# Altium project BatteryMonitor.PrjPcb
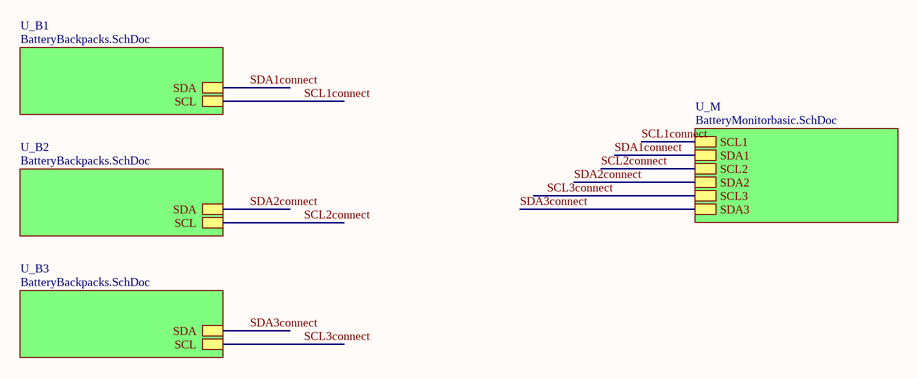
[diagram p0: BatteryMonitor.SchDoc]
3 sheets, 196 parts. Net scope: hierarchical (ports join the sheet entries above them; power ports are global).
Board files: BatteryMonitor1try.PcbDoc, BatteryMonitor.PcbDoc
Sheets:
  BatteryMonitor.SchDoc
    U_B1 = BatteryBackpacks.SchDoc
    U_M = BatteryMonitorbasic.SchDoc
    U_B2 = BatteryBackpacks.SchDoc
    U_B3 = BatteryBackpacks.SchDoc

## Sheet BatteryMonitor.SchDoc
size A

### Sub-sheets
U_B1 = BatteryBackpacks.SchDoc: SCL, SDA
U_B2 = BatteryBackpacks.SchDoc: SCL, SDA
U_B3 = BatteryBackpacks.SchDoc: SCL, SDA
U_M = BatteryMonitorbasic.SchDoc: SCL1, SDA1, SCL2, SDA2, SCL3, SDA3

### Nets
SCL1connect: sheet U_B1/SCL, sheet U_M/SCL1  [project net SCL to I2C isolator 1]
SCL2connect: sheet U_M/SCL2, sheet U_B2/SCL  [project net SCL to I2C isolator 2]
SCL3connect: sheet U_M/SCL3, sheet U_B3/SCL  [project net SCL to I2C isolator 3]
SDA1connect: sheet U_B1/SDA, sheet U_M/SDA1  [project net SDA to I2C isolator 1]
SDA2connect: sheet U_M/SDA2, sheet U_B2/SDA  [project net SDA to I2C isolator 2]
SDA3connect: sheet U_M/SDA3, sheet U_B3/SDA  [project net SDA to I2C isolator 3]

## Sheet BatteryBackpacks.SchDoc
size A
Used 3 times, as channels U_B1, U_B2, U_B3. Parts and nets are listed once, with the designators drawn on the sheet.
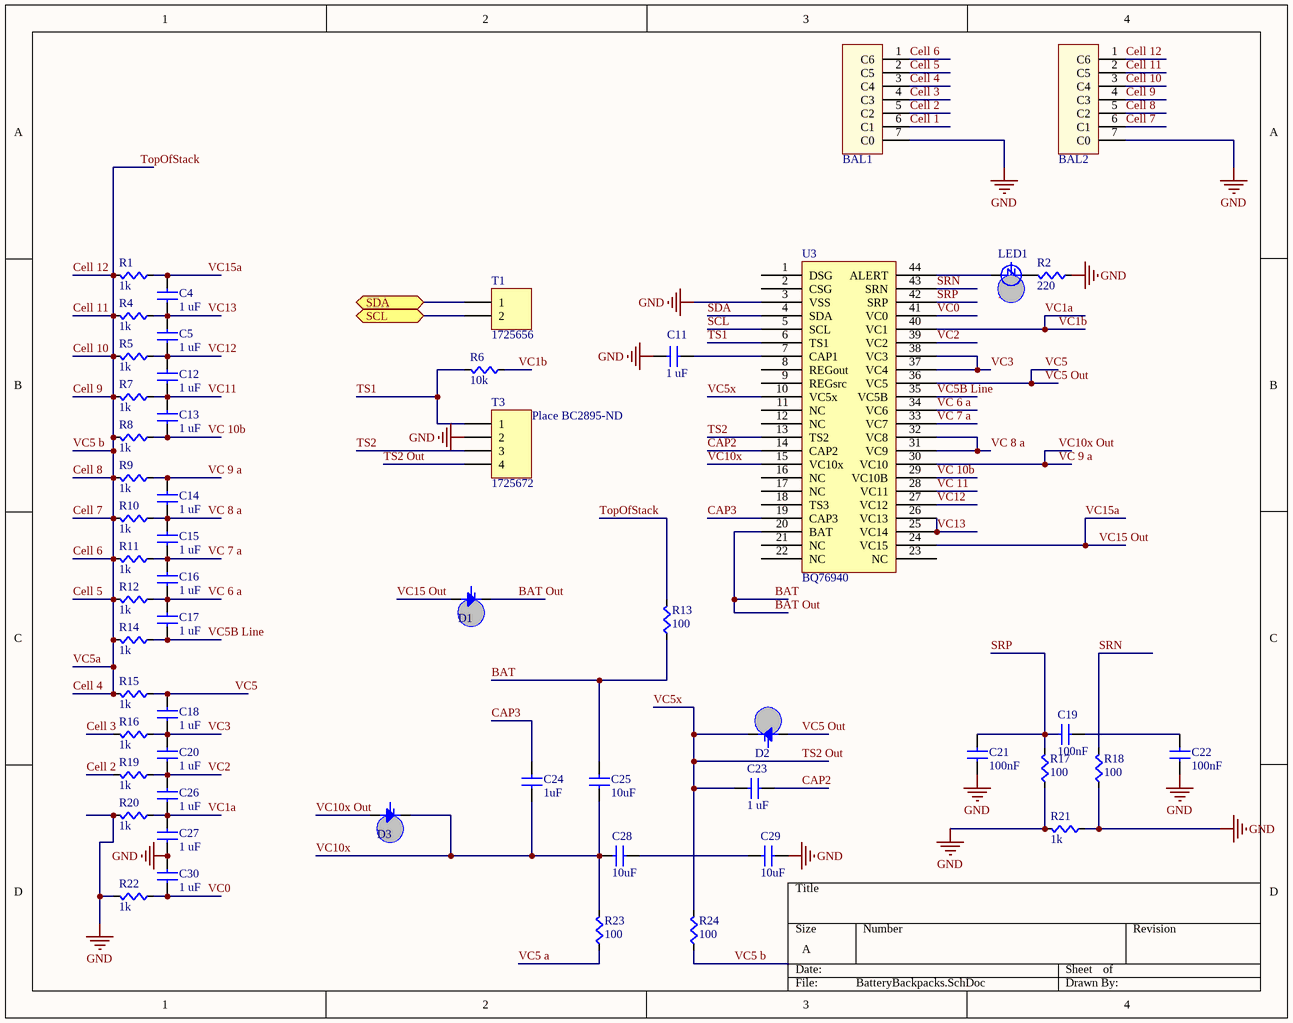
[diagram p1: BatteryBackpacks.SchDoc]

### Parts
BAL1  JST1x7  [JST1x7]  (value not drawn)
BAL2  JST1x7  [JST1x7]  (value not drawn)
C4  value 1 uF  [CAPC0603]  (hidden comment: Cap)
C5  value 1 uF  [CAPC0603]  (hidden comment: Cap)
C11  value 1 uF  [CAPC0603]  (hidden comment: Cap)
C12  value 1 uF  [CAPC0603]  (hidden comment: Cap)
C13  value 1 uF  [CAPC0603]  (hidden comment: Cap)
C14  value 1 uF  [CAPC0603]  (hidden comment: Cap)
C15  value 1 uF  [CAPC0603]  (hidden comment: Cap)
C16  value 1 uF  [CAPC0603]  (hidden comment: Cap)
C17  value 1 uF  [CAPC0603]  (hidden comment: Cap)
C18  value 1 uF  [CAPC0603]  (hidden comment: Cap)
C19  value 100nF  [CAPC0603]  (hidden comment: Cap)
C20  value 1 uF  [CAPC0603]  (hidden comment: Cap)
C21  value 100nF  [CAPC0603]  (hidden comment: Cap)
C22  value 100nF  [CAPC0603]  (hidden comment: Cap)
C23  value 1 uF  [CAPC0603]  (hidden comment: Cap)
C24  value 1uF  [CAPC0603]  (hidden comment: Cap)
C25  value 10uF  [CAPC0603]  (hidden comment: Cap)
C26  value 1 uF  [CAPC0603]  (hidden comment: Cap)
C27  value 1 uF  [CAPC0603]  (hidden comment: Cap)
C28  value 10uF  [CAPC0603]  (hidden comment: Cap)
C29  value 10uF  [CAPC0603]  (hidden comment: Cap)
C30  value 1 uF  [CAPC0603]  (hidden comment: Cap)
D1  Diode  [TEMD5510FX01]  (value not drawn)
D2  Diode  [TEMD5510FX01]  (value not drawn)
D3  Diode  [TEMD5510FX01]  (value not drawn)
LED1  Color: Red  [LED0603]  (hidden comment: LED)
R1  value 1k  [RES0603]  (hidden comment: Res)
R2  value 220  [RES0603]  (hidden comment: Res)
R4  value 1k  [RES0603]  (hidden comment: Res)
R5  value 1k  [RES0603]  (hidden comment: Res)
R6  value 10k  [RES0603]  (hidden comment: Res)
R7  value 1k  [RES0603]  (hidden comment: Res)
R8  value 1k  [RES0603]  (hidden comment: Res)
R9  value 1k  [RES0603]  (hidden comment: Res)
R10  value 1k  [RES0603]  (hidden comment: Res)
R11  value 1k  [RES0603]  (hidden comment: Res)
R12  value 1k  [RES0603]  (hidden comment: Res)
R13  value 100  [RES0603]  (hidden comment: Res)
R14  value 1k  [RES0603]  (hidden comment: Res)
R15  value 1k  [RES0603]  (hidden comment: Res)
R16  value 1k  [RES0603]  (hidden comment: Res)
R17  value 100  [RES0603]  (hidden comment: Res)
R18  value 100  [RES0603]  (hidden comment: Res)
R19  value 1k  [RES0603]  (hidden comment: Res)
R20  value 1k  [RES0603]  (hidden comment: Res)
R21  value 1k  [RES0603]  (hidden comment: Res)
R22  value 1k  [RES0603]  (hidden comment: Res)
R23  value 100  [RES0603]  (hidden comment: Res)
R24  value 100  [RES0603]  (hidden comment: Res)
T1  1725656  [1725656]
T3  1725672  [1725672]
U3  BQ76940  [BQ7694003DBT]

### Ports
SCL, SDA

### Nets
GND: BAL1.7(C0) BAL2.7(C0) C11.1(A) C21.2(B) C22.2(B) C27.1(A) C29.2(B) C30.2(B) R2.2(B) R17.2(B) R18.2(B) R20.1(A) R21.1(A) R21.2(B) R22.1(A) T3.2 U3.3(VSS)
BAT: C25.1(A) D1.C R13.2(B) U3.20(BAT)  [also labelled BAT Out]
CAP2: C23.2(B) U3.14(CAP2)
CAP3: C24.1(A) U3.19(CAP3)
Cell 1: BAL1.6(C1)
Cell 2: BAL1.5(C2) R19.1(A)
Cell 3: BAL1.4(C3) R16.1(A)
Cell 10: BAL1.1(C6) BAL1.2(C5) BAL1.3(C4) BAL2.1(C6) BAL2.2(C5) BAL2.3(C4) BAL2.4(C3) BAL2.5(C2) BAL2.6(C1) R1.1(A) R4.1(A) R5.1(A) R7.1(A) R8.1(A) R9.1(A) R10.1(A) R11.1(A) R12.1(A) R13.1(A) R14.1(A) R15.1(A) R24.2(B)  [also labelled Cell 11, Cell 12, Cell 4, Cell 5, Cell 6, Cell 7, Cell 8, Cell 9, TopOfStack, VC5 b, VC5a]
SCL: U3.5(SCL)
SCL: T1.2 ; port SCL  [a separate net that carries the same name]
SDA: U3.4(SDA)
SDA: T1.1 ; port SDA  [a separate net that carries the same name]
SRN: R18.1(A) U3.43(SRN)
SRP: C19.1(A) C21.1(A) R17.1(A) U3.42(SRP)
TS1: R6.1(A) T3.1 U3.6(TS1)
TS2: T3.3 U3.13(TS2)
TS2 Out: C23.1(A) D2.C R24.1(A) T3.4 U3.10(VC5x)  [also labelled VC5x]
VC0: C30.1(A) R22.2(B) U3.41(VC0)
VC1a: C26.1(A) C27.2(B) R6.2(B) R20.2(B) U3.40(VC1)  [also labelled VC1b]
VC2: C20.1(A) C26.2(B) R19.2(B) U3.39(VC2)
VC3: C18.1(A) C20.2(B) R16.2(B) U3.37(VC4) U3.38(VC3)
VC5: C18.2(B) D2.A R15.2(B) U3.36(VC5)  [also labelled VC5 Out]
VC5 a: R23.2(B)
VC5B Line: C17.1(A) R14.2(B) U3.35(VC5B)
VC10x: C24.2(B) C25.2(B) C28.1(A) D3.C R23.1(A) U3.15(VC10x)
VC11: C12.1(A) C13.2(B) R7.2(B)
VC12: C5.1(A) C12.2(B) R5.2(B) U3.27(VC12)
VC13: C4.1(A) C5.2(B) R4.2(B) U3.25(VC14) U3.26(VC13)
VC15 Out: C4.2(B) D1.A R1.2(B) U3.24(VC15)  [also labelled VC15a]
VC 6 a: C16.1(A) C17.2(B) R12.2(B) U3.34(VC6)
VC 7 a: C15.1(A) C16.2(B) R11.2(B) U3.33(VC7)
VC 8 a: C14.1(A) C15.2(B) R10.2(B) U3.31(VC9) U3.32(VC8)
VC 9 a: C14.2(B) D3.A R9.2(B) U3.30(VC10)  [also labelled VC10x Out]
VC 10b: C13.1(A) R8.2(B) U3.29(VC10B)
VC 11: U3.28(VC11)
NetC11_2: C11.2(B) U3.7(CAP1)
NetC19_2: C19.2(B) C22.1(A)
NetC28_2: C28.2(B) C29.1(A)
NetLED1_A: LED1.A U3.44(ALERT)
NetLED1_C: LED1.C R2.1(A)

Not connected (* = marked no-connect by the designer): U3 1(DSG) 2(CSG) 8(REGout) 9(REGsrc) 11(NC) 12(NC) 16(NC) 17(NC) 18(TS3) 21(NC) 22(NC) 23(NC)

### Channels
U_B1: designators end in _U_B1; ports SCL=SCL to I2C isolator 1 SDA=SDA to I2C isolator 1
U_B2: designators end in _U_B2; ports SCL=SCL to I2C isolator 2 SDA=SDA to I2C isolator 2
U_B3: designators end in _U_B3; ports SCL=SCL to I2C isolator 3 SDA=SDA to I2C isolator 3

### Notes on the sheet
- Place BC2895-ND

### Library data of the parts
BAL1 BAL2 = JST1x7: CONN HEADER XH SIDE 7POS 2.5MM; Supplier 1: Digi-Key; Supplier Part Number 1: 455-2240-ND
D1-D3 = Diode: Standard Diode Template
T1 = 1725656: CONN TERM BLOCK 2.54MM 2POS; Supplier 1: Digi-Key; Supplier Part Number 1: 277-1273-ND
T3 = 1725672: CONN TERM BLOCK 2.54MM 4POS; Supplier 1: Digi-Key; Supplier Part Number 1: 277-1275-ND
U3 = BQ76940: IC BATT MFMT LI-ION AFE 44TSOP; Supplier 1: Digi-Key; Supplier Part Number 1: 296-37789-5-ND
C4 C5 C11-C30 = Cap: Supplier 1: Digi-Key
  C4 C5 C11-C18 C20 C23 C24 C26 C27 C30: Supplier Part Number 1: 1276-1946-1-ND
  C19 C21 C22: Supplier Part Number 1: 1276-1000-1-ND
  C25 C28 C29: Supplier Part Number 1: 587-3383-1-ND
LED1 = LED: Supplier 1: Digi-Key; Supplier Part Number 1: 754-1122-1-ND
R1 R2 R4-R24 = Res: Supplier 1: Digi-Key
  R1 R4 R5 R7-R12 R14-R16 R19-R22: Supplier Part Number 1: RHM1.00KCFCT-ND
  R2: Supplier Part Number 1: RHM220CGCT-ND
  R6: Supplier Part Number 1: RMCF0603JT10K0CT-ND
  R13 R17 R18 R23 R24: Supplier Part Number 1: P100GCT-ND

## Sheet BatteryMonitorbasic.SchDoc
size A
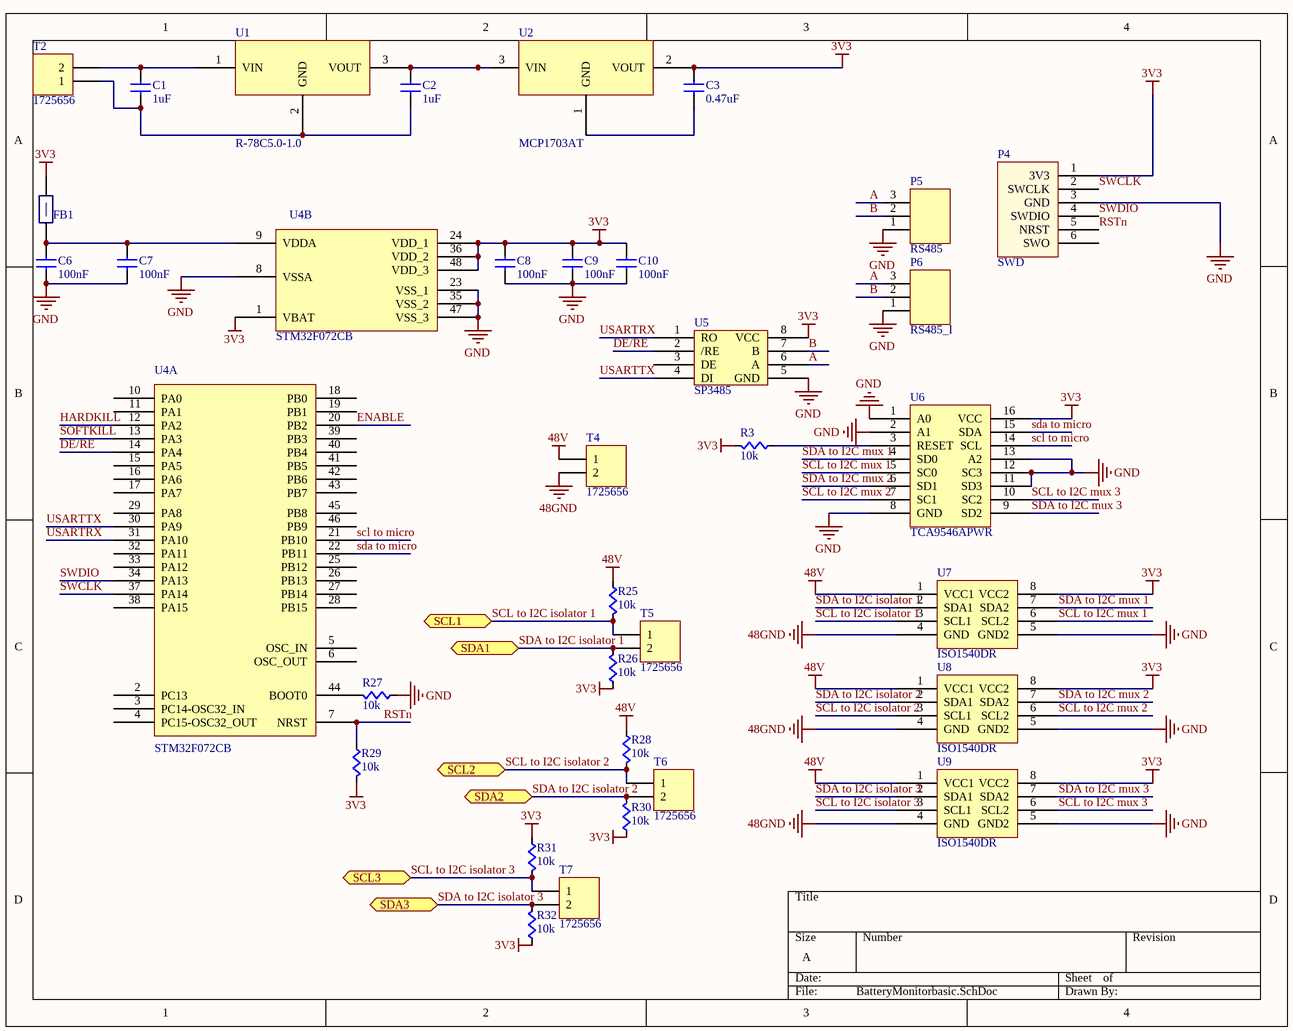
[diagram p2: BatteryMonitorbasic.SchDoc]

### Parts
C1  value 1uF  [CAPC0603]  (hidden comment: Cap)
C2  value 1uF  [CAPC0603]  (hidden comment: Cap)
C3  value 0.47uF  [CAPC0603]  (hidden comment: Cap)
C6  value 100nF  [CAPC0603]  (hidden comment: Cap)
C7  value 100nF  [CAPC0603]  (hidden comment: Cap)
C8  value 100nF  [CAPC0603]  (hidden comment: Cap)
C9  value 100nF  [CAPC0603]  (hidden comment: Cap)
C10  value 100nF  [CAPC0603]  (hidden comment: Cap)
FB1  FBead  [RES0603]  (value not drawn)
P4  SWD  [SWD_STM32]
P5  RS485  [MOLEX-HDR-1X3-SHERLOCK-RA]
P6  RS485_I  [MOLEX-HDR-1X3-SHERLOCK-RA]
R3  value 10k  [RES0603]  (hidden comment: Res)
R25  value 10k  [RES0603]  (hidden comment: Res)
R26  value 10k  [RES0603]  (hidden comment: Res)
R27  value 10k  [RES0603]  (hidden comment: Res)
R28  value 10k  [RES0603]  (hidden comment: Res)
R29  value 10k  [RES0603]  (hidden comment: Res)
R30  value 10k  [RES0603]  (hidden comment: Res)
R31  value 10k  [RES0603]  (hidden comment: Res)
R32  value 10k  [RES0603]  (hidden comment: Res)
T2  1725656  [1725656]
T4  1725656  [1725656]
T5  1725656  [1725656]
T6  1725656  [1725656]
T7  1725656  [1725656]
U1  R-78C5.0-1.0  [R-78C5.0-1.0]
U2  MCP1703AT  [MCP1703AT-xx02EDB]
U4  STM32F072CB  [STM32F072CB]  (parts A,B of 2)
U5  SP3485  [SP3485]
U6  TCA9546APWR  [TCA9546APWR/TSOP65P640X120-16N]
U7  ISO1540DR  [ISO1540DR]
U8  ISO1540DR  [ISO1540DR]
U9  ISO1540DR  [ISO1540DR]

### Ports
SCL1, SCL2, SCL3, SDA1, SDA2, SDA3

### Nets
3V3: C3.1(A) C8.1(A) C9.1(A) C10.1(A) FB1.2(B) P4.1(3V3) R3.1(A) R26.2(B) R29.1(A) R30.2(B) R31.1(A) R32.2(B) U2.2(VOUT) U4.1(VBAT) U4.24(VDD_1) U4.36(VDD_2) U4.48(VDD_3) U5.8(VCC) U6.16(VCC) U7.8(VCC2) U8.8(VCC2) U9.8(VCC2)
48GND: T4.2 U7.4(GND) U8.4(GND) U9.4(GND)
48V: R25.1(A) R28.1(A) T4.1 U7.1(VCC1) U8.1(VCC1) U9.1(VCC1)
GND: C6.2(B) C7.2(B) C8.2(B) C9.2(B) C10.2(B) P4.3(GND) P5.1 P6.1 R27.2(B) U4.8(VSSA) U4.23(VSS_1) U4.35(VSS_2) U4.47(VSS_3) U5.5(GND) U6.1(A0) U6.2(A1) U6.8(GND) U6.11(SD3) U6.12(SC3) U6.13(A2) U7.5(GND2) U8.5(GND2) U9.5(GND2)
A: P5.3 P6.3 U5.6(A)
B: P5.2 P6.2 U5.7(B)
DE/RE: U4.14(PA4) U5.2(/RE)
ENABLE: U4.20(PB2)
HARDKILL: U4.12(PA2)
RSTn: P4.5(NRST) R29.2(B) U4.7(NRST)
SCL to I2C isolator 1: R25.2(B) T5.1 U7.3(SCL1) ; port SCL1
SCL to I2C isolator 2: R28.2(B) T6.1 U8.3(SCL1) ; port SCL2
SCL to I2C isolator 3: R31.2(B) T7.1 U9.3(SCL1) ; port SCL3
SCL to I2C mux 1: U6.5(SC0) U7.6(SCL2)
SCL to I2C mux 2: U6.7(SC1) U8.6(SCL2)
SCL to I2C mux 3: U6.10(SC2) U9.6(SCL2)
scl to micro: U4.21(PB10) U6.14(SCL)
SDA to I2C isolator 1: R26.1(A) T5.2 U7.2(SDA1) ; port SDA1
SDA to I2C isolator 2: R30.1(A) T6.2 U8.2(SDA1) ; port SDA2
SDA to I2C isolator 3: R32.1(A) T7.2 U9.2(SDA1) ; port SDA3
SDA to I2C mux 1: U6.4(SD0) U7.7(SDA2)
SDA to I2C mux 2: U6.6(SD1) U8.7(SDA2)
SDA to I2C mux 3: U6.9(SD2) U9.7(SDA2)
sda to micro: U4.22(PB11) U6.15(SDA)
SOFTKILL: U4.13(PA3)
SWCLK: P4.2(SWCLK) U4.37(PA14)
SWDIO: P4.4(SWDIO) U4.34(PA13)
USARTRX: U4.31(PA10) U5.1(RO)
USARTTX: U4.30(PA9) U5.4(DI)
NetC1_1: C1.1(A) T2.2 U1.1(VIN)
NetC1_2: C1.2(B) C2.2(B) T2.1 U1.2(GND)
NetC2_1: C2.1(A) U1.3(VOUT) U2.3(VIN)
NetC3_2: C3.2(B) U2.1(GND)
NetC6_1: C6.1(A) C7.1(A) FB1.1(A) U4.9(VDDA)
NetR3_2: R3.2(B) U6.3(RESET)
NetR27_1: R27.1(A) U4.44(BOOT0)

Not connected (* = marked no-connect by the designer): P4 6(SWO); U4 2(PC13) 3(PC14-OSC32_IN) 4(PC15-OSC32_OUT) 5(OSC_IN) 6(OSC_OUT) 10(PA0) 11(PA1) 15(PA5) 16(PA6) 17(PA7) 18(PB0) 19(PB1) 25(PB12) 26(PB13) 27(PB14) 28(PB15) 29(PA8) 32(PA11) 33(PA12) 38(PA15) 39(PB3) 40(PB4) 41(PB5) 42(PB6) 43(PB7) 45(PB8) 46(PB9); U5 3(DE)

### Library data of the parts
FB1 = FBead: Ferrite Bead; Supplier 1: Digi-Key; Supplier Part Number 1: 445-2988-1-ND
P4 = SWD_STM32: SWD connector matching the pinout on STM Discovery Boards
P5 P6 = MOLEX-HDR-1x3-SHERLOCK_RA: Header, Molex, 2mm Pitch Sherlock Header, Single Row, Right Angle 3 Circuits, Length 3.3mm; Manufacturer Part Number: 35363-0360; Manufacturer: Molex Connector Corporation; Supplier Part Number 1: WM18932-ND; Supplier 1: Digi-Key
T2 T4-T7 = 1725656: CONN TERM BLOCK 2.54MM 2POS; Supplier 1: Digi-Key; Supplier Part Number 1: 277-1273-ND
U1 = R-78C5.0-1.0: CONV DC/DC 1A 5V OUT SIP VERT; Supplier 1: Digi-Key; Supplier Part Number 1: 945-1395-5-ND
U2 = MCP1703AT: 250 mA, 16V, Low Quiescent Current LDO Regulator; Supplier 1: Digi-Key; Supplier Part Number 1: MCP1703AT-3302E/CBCT-ND
U4 = STM32F072CB: MCU 32BIT 128KB FLASH 48LQFP; Supplier 1: Digi-Key; Supplier Part Number 1: 497-14645-ND
U5 = SP3485: IC TXRX RS485 HALF DUPLEX 8NSOIC; Supplier 1: Digi-Key; Supplier Part Number 1: 1016-1817-1-ND
U6 = TCA9546APWR: IC I2C SW 4CH W/RESET 16TSSOP; Supplier 1: Digi-key; Supplier Part Number 1: 296-40578-1-ND
U7-U9 = ISO1540DR: DGTL ISO 2.5KV 2CH I2C 8SOIC; Supplier 1: Digi-Key; Supplier Part Number 1: ISO1540DR
C1-C3 C6-C10 = Cap: Supplier 1: Digi-Key; Supplier Part Number 1: 1276-1000-1-ND
R3 R25-R32 = Res: Supplier 1: Digi-Key; Supplier Part Number 1: RMCF0603JT10K0CT-ND

## Nets that join several sheets
GND: U_B1 (17 pins), BatteryMonitorbasic (23 pins), U_B2 (17 pins), U_B3 (17 pins)
SCL to I2C isolator 1: U_B1 (T1_U_B1.2), BatteryMonitorbasic (R25.2 T5.1 U7.3)
SCL to I2C isolator 2: BatteryMonitorbasic (R28.2 T6.1 U8.3), U_B2 (T1_U_B2.2)
SCL to I2C isolator 3: BatteryMonitorbasic (R31.2 T7.1 U9.3), U_B3 (T1_U_B3.2)
SDA to I2C isolator 1: U_B1 (T1_U_B1.1), BatteryMonitorbasic (R26.1 T5.2 U7.2)
SDA to I2C isolator 2: BatteryMonitorbasic (R30.1 T6.2 U8.2), U_B2 (T1_U_B2.1)
SDA to I2C isolator 3: BatteryMonitorbasic (R32.1 T7.2 U9.2), U_B3 (T1_U_B3.1)